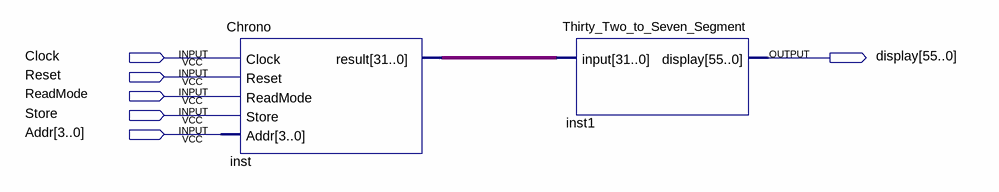
[diagram p0: schematic sheet]
// Quartus schematic Final.bdf as structural Verilog: 2 symbols, 6 pins
module Final (
  input  Clock,
  input  Reset,
  input  ReadMode,
  input  Store,
  input  [3:0] Addr,
  output [55:0] display
);

  wire [31:0] inst_result;

  Chrono inst (.Clock(Clock), .Reset(Reset), .ReadMode(ReadMode), .Store(Store), .Addr(Addr), .result(inst_result));
  Thirty_Two_to_Seven_Segment inst1 (.\input (inst_result), .display(display));
endmodule
